# Altium schematic sheet Connector-side-2.SchDoc: =ProjectTitle
size 297 x 209 mm; Address1: Address1; Address2: Address2; Address3: Address3; Address4: Address4; SheetNumber: 5; SheetTotal: 7; Scale: 1:1; DocumentType: Схема электрическая принципиальная
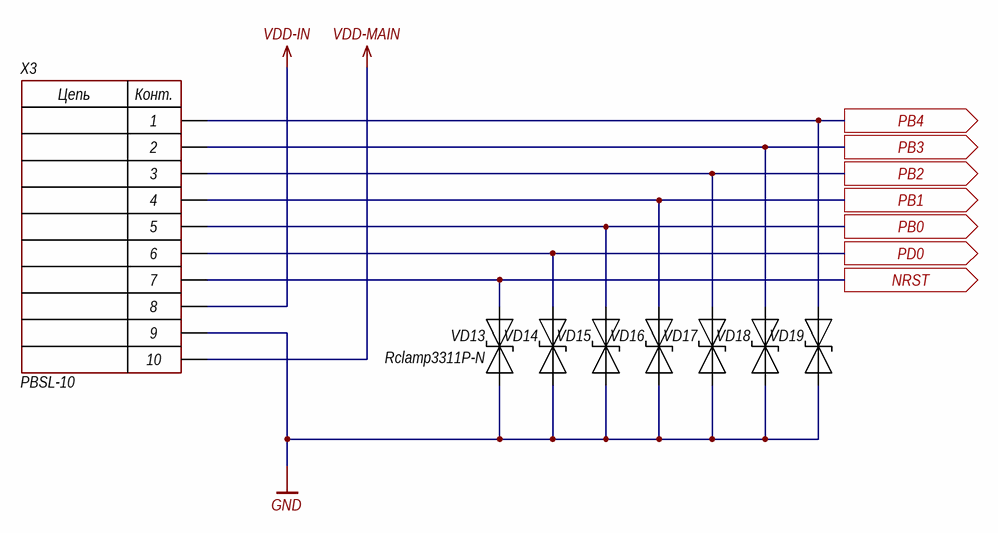
[diagram p0: Connector-side-2.SchDoc]

## Parts
VD13  Rclamp3311P-N  [DFN1006-2]
VD14  Rclamp3311P-N  [DFN1006-2]  (value not drawn)
VD15  Rclamp3311P-N  [DFN1006-2]  (value not drawn)
VD16  Rclamp3311P-N  [DFN1006-2]  (value not drawn)
VD17  Rclamp3311P-N  [DFN1006-2]  (value not drawn)
VD18  Rclamp3311P-N  [DFN1006-2]  (value not drawn)
VD19  Rclamp3311P-N  [DFN1006-2]  (value not drawn)
X3  PBSL-10  [CON: PBSL-10]

## Ports
NRST (out), PB0 (out), PB1 (out), PB2 (out), PB3 (out), PB4 (out), PD0 (out)

## Nets
GND: VD13.1(A) VD14.1(A) VD15.1(A) VD16.1(A) VD17.1(A) VD18.1(A) VD19.1(A) X3.9
VDD-IN: X3.8
VDD-MAIN: X3.10
NRST: VD13.2(C) X3.7 ; port NRST
PB0: VD15.2(C) X3.5 ; port PB0
PB1: VD16.2(C) X3.4 ; port PB1
PB2: VD17.2(C) X3.3 ; port PB2
PB3: VD18.2(C) X3.2 ; port PB3
PB4: VD19.2(C) X3.1 ; port PB4
PD0: VD14.2(C) X3.6 ; port PD0

## Notes on the sheet
- Изм.
- Лист
- № докум.
- Подп.
- Дата
- Копировал
- Формат А4
- (in symbol 10-Connector) Цепь; Конт.

## Library data of the parts
VD13-VD19 = TVS-diod: Manufacturer: BORN; ComponentKind: 3.3V, 8V. 10A; Model: Rclamp3311P-N; HelpURL: https://www.lcsc.com/product-detail/ESD-Protection-Devices_BORN-Rclamp3311P-N_C406234.html
X3 = 10-Connector: Model: PBSL-10; Manufacturer: *; HelpURL: *; ComponentKind: *